# Altium schematic sheet inmux.SCHDOC
size A
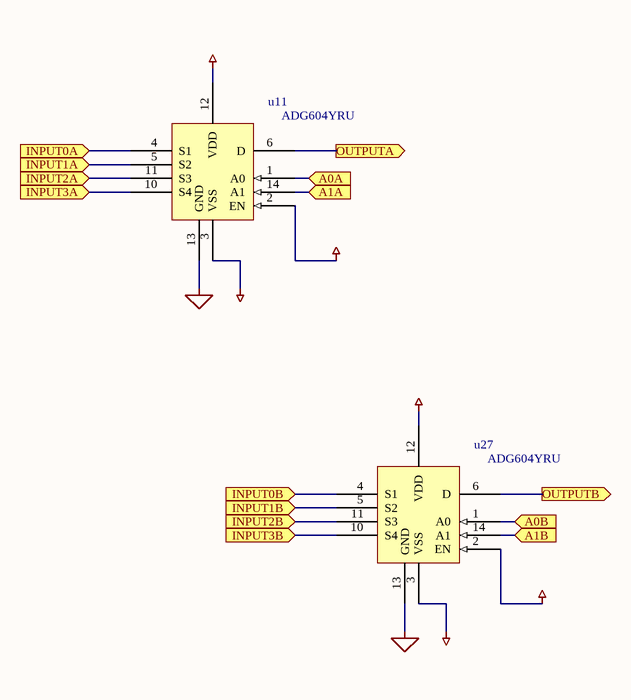
[diagram p0: inmux.SCHDOC]

## Parts
u11  ADG604YRU  [SSO-G14/X.4]
u27  ADG604YRU  [SSO-G14/X.4]

## Ports
A0A (in), A0B (in), A1A (in), A1B (in), INPUT0A (in), INPUT0B (in), INPUT1A (in), INPUT1B (in), INPUT2A (in), INPUT2B (in), INPUT3A (in), INPUT3B (in), OUTPUTA (out), OUTPUTB (out)

## Nets
AGND: u11.13(GND) u27.13(GND)
AVDD: u11.2(EN) u11.12(VDD) u27.2(EN) u27.12(VDD)
AVSS: u11.3(VSS) u27.3(VSS)
A0A: u11.1(A0) ; port A0A
A0B: u27.1(A0) ; port A0B
A1A: u11.14(A1) ; port A1A
A1B: u27.14(A1) ; port A1B
INPUT0A: u11.4(S1) ; port INPUT0A
INPUT0B: u27.4(S1) ; port INPUT0B
INPUT1A: u11.5(S2) ; port INPUT1A
INPUT1B: u27.5(S2) ; port INPUT1B
INPUT2A: u11.11(S3) ; port INPUT2A
INPUT2B: u27.11(S3) ; port INPUT2B
INPUT3A: u11.10(S4) ; port INPUT3A
INPUT3B: u27.10(S4) ; port INPUT3B
OUTPUTA: u11.6(D) ; port OUTPUTA
OUTPUTB: u27.6(D) ; port OUTPUTB

## Library data of the parts
u11 u27 = ADG604: 1 pC Charge Injection 100pA leakage CMOS 4-channel mux